# EAGLE design Zio OLED Display (EAGLE 8.4.1)
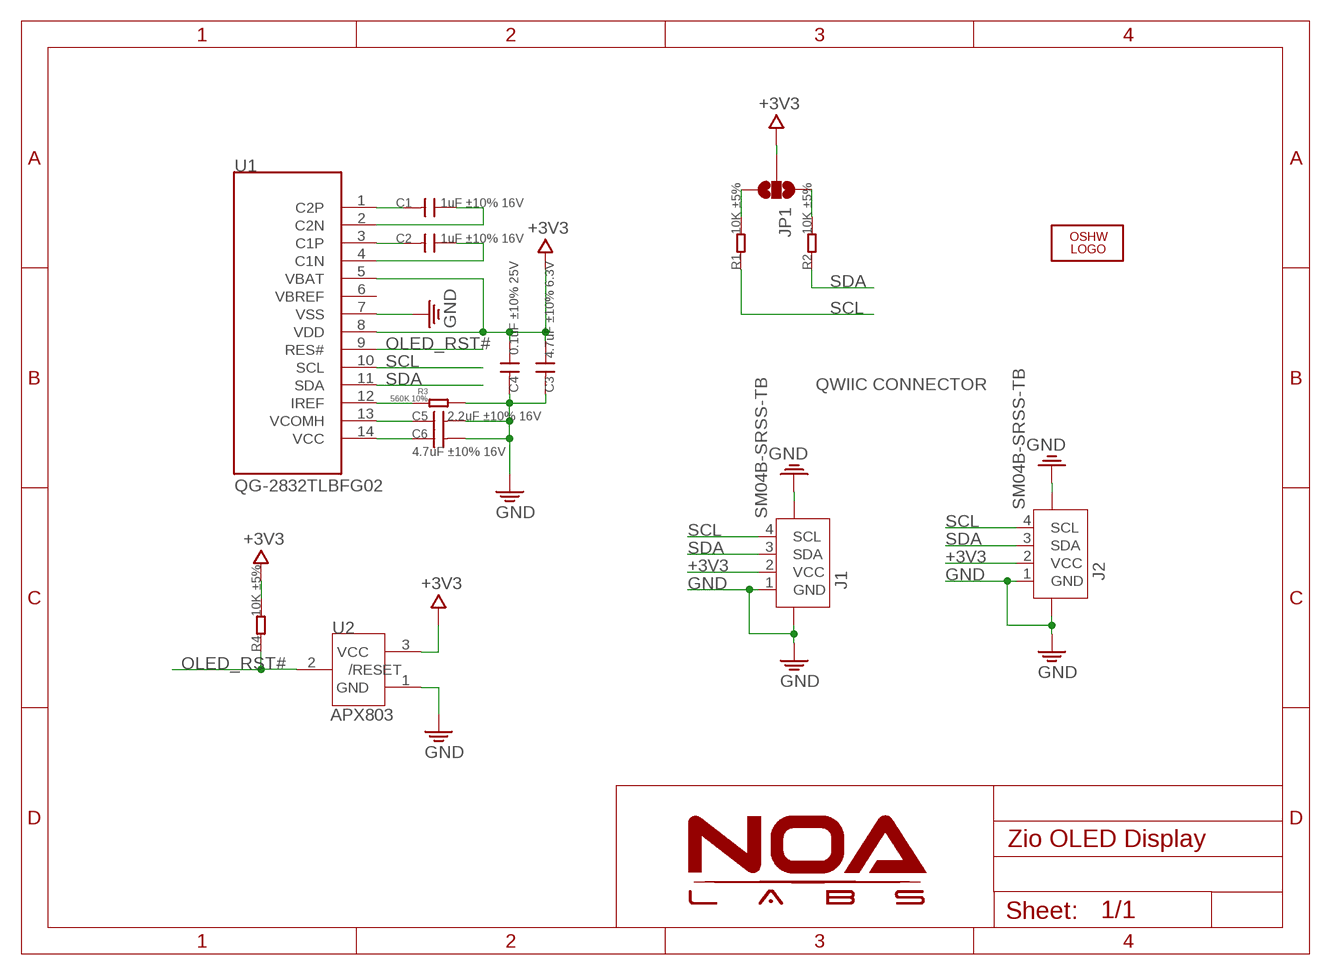
[diagram p0: schematic, sheet 1]

## Parts
C1  1uF ±10% 16V  C-0603  [0603]
C2  1uF ±10% 16V  C-0603  [0603]
C3  4.7uF ±10% 6.3V  C-0603  [0603]
C4  0.1uF ±10% 25V  C-0603  [0603]
C5  2.2uF ±10% 16V  C-0603  [0603]
C6  4.7uF ±10% 16V  C-0603  [0603]
J1  SM04B-SRSS-TB  JST-SH-4P-1.0  [JST-SH-4P]
J2  SM04B-SRSS-TB  JST-SH-4P-1.0  [JST-SH-4P]
JP1  JUMPER-SMT_3_2-NC_PASTE_NOCREM  [SMT-JUMPER_3_2-NC_PASTE_SILK_NOCREM]
LOGO1  LOGO-OSHW-6MILX0070-NT  [OSHW_6X70_NOTEXT]
R1  10K ±5%  R-0603  [0603]
R2  10K ±5%  R-0603  [0603]
R3  560K 10%  R-0603  [0603]
R4  10K ±5%  R-0603  [0603]
U1  QG-2832TLBFG02  OLED-12832  [OLED-12832]
U2  APX803  [SOT23]

## Nets
+3V3: C3.1 C4.1 J1.2(VCC) J2.2(VCC) JP1.2 R4.2 U1.5(VBAT) U1.8(VDD) U2.3(VCC)
GND: C3.2 C4.2 C5.2 C6.2 J1.1(GND) J1.NC1 J1.NC2 J2.1(GND) J2.NC1 J2.NC2 R3.1 U1.7(VSS) U2.1(GND)
N$1: C1.2 U1.1(C2P)
N$2: C1.1 U1.2(C2N)
N$3: C2.2 U1.3(C1P)
N$4: C2.1 U1.4(C1N)
N$5: JP1.3 R1.2
N$6: C5.1 U1.13(VCOMH)
N$7: C6.1 U1.14(VCC)
N$8: JP1.1 R2.2
N$9: R3.2 U1.12(IREF)
OLED_RST#: R4.1 U1.9(RES#) U2.2(/RESET)
SCL: J1.4(SCL) J2.4(SCL) R1.1 U1.10(SCL)
SDA: J1.3(SDA) J2.3(SDA) R2.1 U1.11(SDA)
Unconnected: U1.6(VBREF)

## Notes on the sheet
- QWIIC CONNECTOR

## Library data of the parts
C1-C6 = Discrete:C*: Ceramic Capacitors
J1 J2 = Connector:JST-SH-4P
JP1 = NOA-Jumpers:JUMPER-SMT_3_2-NC_PASTE_NOCREM
LOGO1 = Logo:LOGO-OSHW-6MIL
R1-R4 = Discrete:R*
U1 = Module:OLED-12832
U2 = IC:APX803

## Board
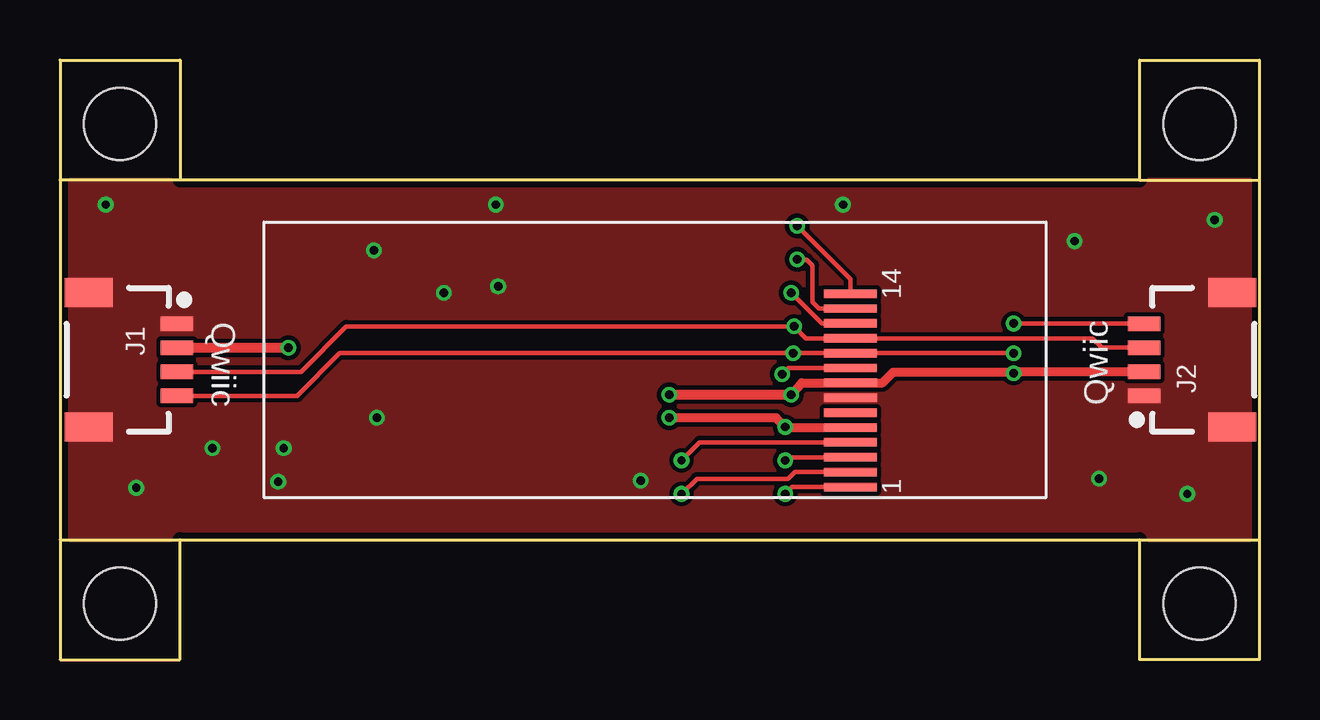
[diagram p1: board, top side]
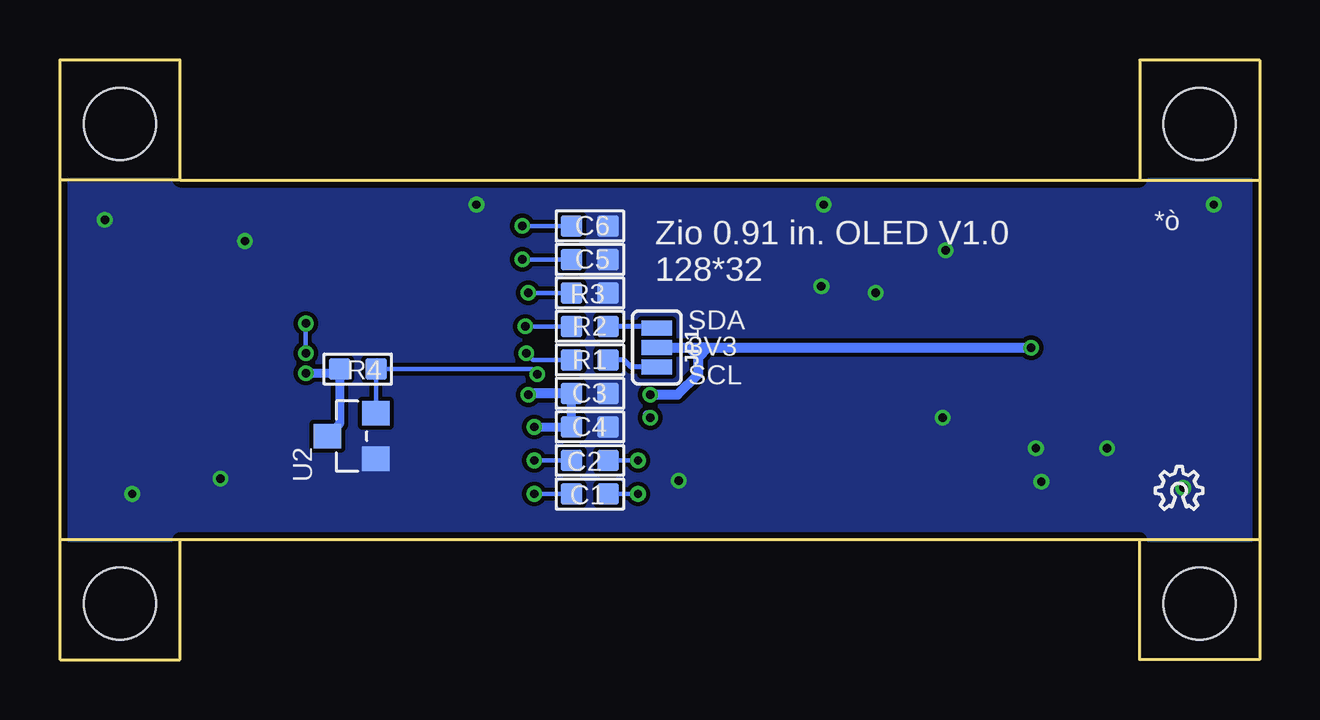
[diagram p2: board, bottom side, seen from below]

Size 50 x 25 mm. Coordinates in mm from the lower left corner, seen from the top.
Outline: 5,5 45,5 45,0 50,0 50,25 45,25 45,20 5,20 5,25 0,25 0,0 5,0 5,5
Copper layers (1*16): Top 0.035mm / dielectric 1.5mm / Bottom 0.035mm
Design rules "NOA Eagle Rule *": minimum track width 7mil, minimum drill 12mil, track to track 7mil, track to pad 7mil, pad to pad 7mil, via to via 7mil, smd to smd 0mil, copper to edge 10mil, drill to drill 10mil, minimum pad ring 10mil, minimum via ring 6mil, stop-mask expansion 2mil, vias tented up to drill 25mil, thermal gap 10mil
Holes 3 mm at 2.5,22.34 2.5,2.34 47.5,2.34 47.5,22.34
Milling: 4 lines

### Footprints (pad centres in the part's own frame; a part is rotated, then mirrored left to right if it is on the bottom)
0603 = smd 0.889 x 0.889: 1 -0.762,0; 2 0.762,0
JST-SH-4P = smd 0.6 x 1.35: 1 1.5,0; 2 0.5,0; 3 -0.5,0; 4 -1.5,0 | smd 1.2 x 2: NC1 -2.8,3.675; NC2 2.8,3.675
SMT-JUMPER_3_2-NC_PASTE_SILK_NOCREM = smd 0.635 x 1.27: 1 -0.813,0; 2 0,0; 3 0.813,0
OLED-12832 = smd 2.2 x 0.35: 1 24.445,0.445; 2 24.445,1.065; 3 24.445,1.685; 4 24.445,2.305; 5 24.445,2.925; 6 24.445,3.545; 7 24.445,4.165; 8 24.445,4.785; 9 24.445,5.405; 10 24.445,6.025; 11 24.445,6.645; 12 24.445,7.265; 13 24.445,7.885; 14 24.445,8.505
SOT23 = smd 1.016 x 1.143: 1 -0.95,-1.016; 2 0.95,-1.016; 3 0,1.016

### Placement (x,y rotation side)
C1  27.91,6.91 180 bottom
C2  27.91,8.3 180 bottom
C3  27.91,11.1 0 bottom
C4  27.91,9.7 0 bottom
C5  27.91,16.68 0 bottom
C6  27.91,18.08 0 bottom
E$10  [7MM]  34.21,13.13 0 bottom
J1  4.88,12.5 90 top
J2  45.19,12.5 270 top
JP1  25.12,13.01 270 bottom
LOGO1  4.34,6.27 0 bottom
R1  27.91,12.49 0 bottom
R2  27.91,13.89 0 bottom
R3  27.91,15.29 180 bottom
R4  37.59,12.11 180 bottom
U1  8.5,6.75 0 top
U2  37.85,9.32 90 bottom
U$3  [6MM]  41.43,15.82 0 top

### Tracks (layer width: path | path; a pad name or v marks a point on that pad's centre or on a via)
+3V3  (via drill 0.35)
  Top 0.178: J2.2 45.08,12 45.06,11.98
  Top 0.381: v30.48,11.04 30.92,11.54 U1.8 34.28,11.54 34.73,11.98 39.75,11.98 | U1.5 30.25,9.68 v30.23,9.7 29.84,10.08 v25.4,10.08 | 45.06,11.98 39.75,11.98 | 39.75,11.98 v39.75,11.94
  Top 0.406: v25.4,11.04 v30.48,11.04 | v9.53,13 v9.52,13 J1.2
  Bottom 0.381: 28.67,11.05 C3.1 | 28.67,11.05 C4.1 v30.23,9.7 | 28.71,11.1 28.67,11.05 | 25.53,10.21 v25.4,10.08 | v39.75,11.94 38.52,11.94 R4.2 38.35,9.83 U2.3
  Bottom 0.406: 9.53,12.96 v9.53,13 23.01,13 | 23.01,13 23.32,13 | 23.77,13 23.32,13 | 23.77,13 24.69,13 24.7,13.01 JP1.2 | 23.32,13 23.39,12.93 23.39,11.91 24.26,11.04 v25.4,11.04 | 23.01,13 23.39,12.62 23.77,13 | C3.1 30.43,11.1 v30.48,11.04
GND  (via drill 0.35)
  other vias: 13.08,17.06 3.17,7.16 9.32,8.81 16,15.29 18.26,15.57 42.29,17.45 46.99,6.91 43.31,7.54 48.13,18.34 1.91,18.97 24.21,7.46 6.35,8.81 9.09,7.41 32.64,18.97 18.16,18.97 13.21,10.08
  pour Top (no thermals): 0,5 49.99,5 49.99,19.99 0,19.99
  pour Bottom (no thermals): 0,5 50.01,5 50.01,19.99 0,19.99
N$1  (via drill 0.35)
  Top 0.178: U1.1 30.52,7.2 v30.23,6.91
  Bottom 0.178: v30.23,6.91 C1.2
N$2  (via drill 0.35)
  Top 0.178: U1.2 30.63,7.81 30.35,7.54 26.54,7.54 v25.91,6.91
  Bottom 0.178: v25.91,6.91 C1.1
N$3  (via drill 0.35)
  Top 0.178: U1.3 30.36,8.44 v30.23,8.3
  Bottom 0.178: v30.23,8.3 C2.2
N$4  (via drill 0.35)
  Top 0.178: U1.4 26.66,9.05 v25.91,8.3
  Bottom 0.178: v25.91,8.3 C2.1
N$5
  Bottom 0.203: R1.2 26.49,12.49 26.2,12.2 JP1.3
  Bottom 0.381: R1.2 27.15,12.54 27.1,12.49
N$6  (via drill 0.35)
  Top 0.178: U1.13 31.64,14.63 31.37,14.91 31.37,16.43 31.11,16.68 v30.73,16.68
  Bottom 0.178: v30.73,16.68 C5.1
N$7  (via drill 0.35)
  Top 0.178: U1.14 32.95,15.87 v30.73,18.08
  Bottom 0.178: v30.73,18.08 C6.1
N$8
  Bottom 0.203: JP1.1 25.19,13.89 R2.2
N$9  (via drill 0.35)
  Top 0.178: U1.12 31.75,14.02 v30.48,15.29
  Bottom 0.178: R3.2 v30.48,15.29
OLED_RST#  (via drill 0.35)
  Top 0.178: U1.9 30.36,12.16 v30.11,11.9
  Bottom 0.178: R4.1 | R4.1 30.32,12.11 v30.11,11.9 | U2.2 R4.1
SCL  (via drill 0.35)
  Top 0.178: v39.75,12.78 U1.10 v30.56,12.78 11.66,12.78 9.89,11 J1.4 | 44.58,14.01 v39.75,14.01 | 44.58,14.01 44.89,14.01 | J2.4 44.59,14 44.58,14.01
  Bottom 0.178: R1.1 30.28,12.49 v30.56,12.78 | v39.75,12.78 v39.75,14.01
SDA  (via drill 0.35)
  Top 0.178: 44.7,13 43.43,13 43.04,13.39 U1.11 31.1,13.39 v30.61,13.89 11.93,13.89 10.04,12 J1.3 | 44.7,13 45.08,13 | J2.3 44.7,13
  Bottom 0.178: R2.1 v30.61,13.89

### Text on the board
tPlace: 14 | Qwiic | Qwiic | 1
bPlace: *ò | Zio 0.91 in. OLED V1.0 / 128*32 | SDA | 3V3 | SCL | C:/Users/NOA-01/Documents/eagle/Eagle/ulp/logo/NOA Logo - for Screen - 1000x435 + White Background Mirror.bmp